# EAGLE schematic Schematic (EAGLE 7.3.0)
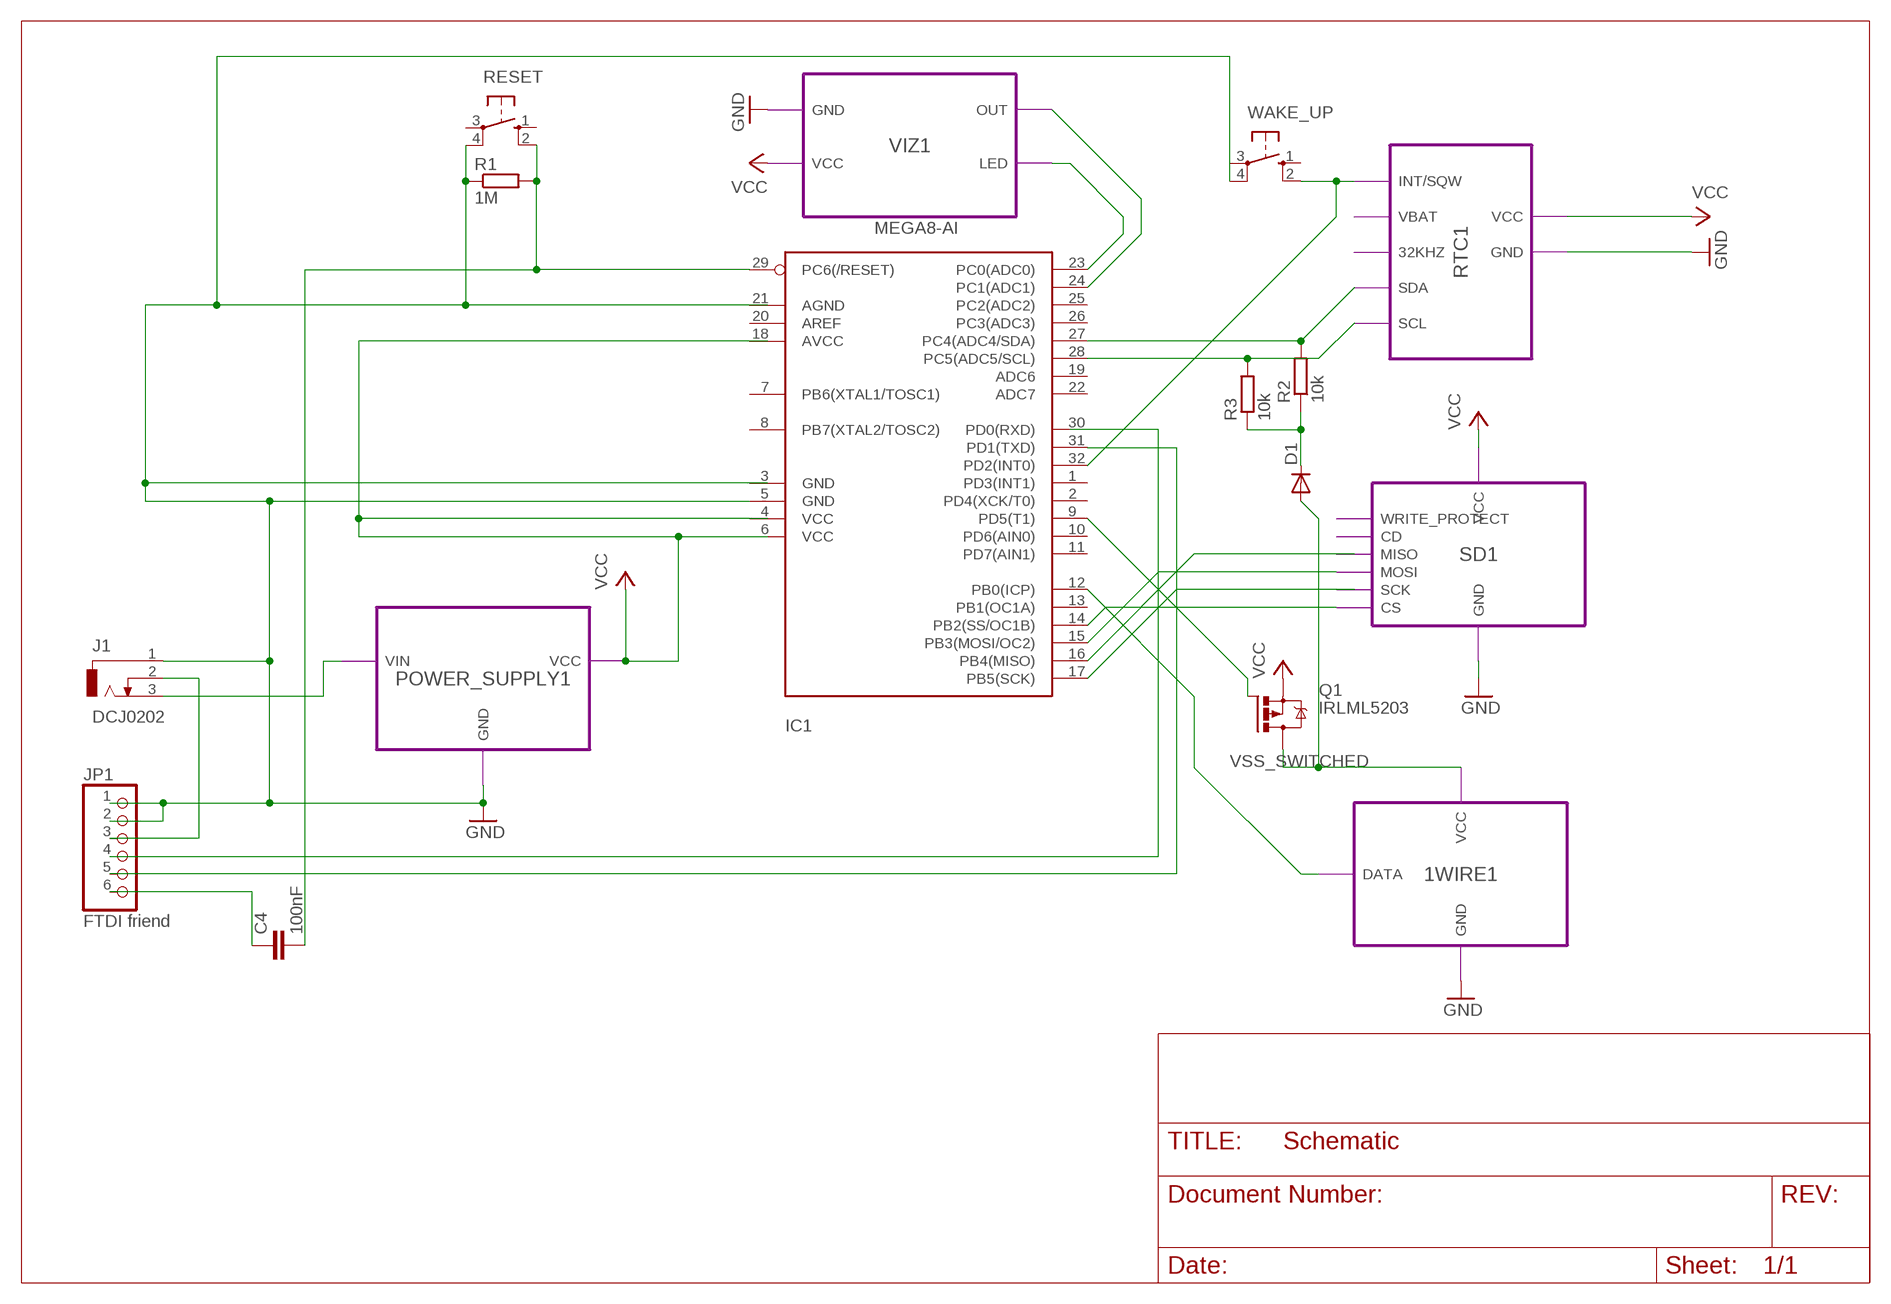
[diagram p0: schematic, sheet 1]

## Parts
C4  100nF  CC1608  [C1608]
D1  DIODE-DO214AA  [DO214AA]
IC1  MEGA8-AI  [TQFP32-08]
J1  DCJ0202  [DCJ0202]
JP1  FTDI friend  PINHD-1X6/90  [1X06/90]
Q1  IRLML5203  [MICRO3]
R1  1M  R-EU_R1206  [R1206]
R2  10k  R-EU_R1206  [R1206]
R3  10k  R-EU_R1206  [R1206]
RESET  10-XX  [B3F-10XX]
WAKE_UP  10-XX  [B3F-10XX]

## Module instances
POWER_SUPPLY1 = POWER_SUPPLY
RTC1 = RTC
SD1 = SDCARD
1WIRE1 = ONE_WIRE
VIZ1 = VISIBILITY_SENSOR

## Nets
DTR: C4.1 JP1.6
GND: IC1.5(GND) J1.1 JP1.1 JP1.2 R1.1 RESET.4(P1) WAKE_UP.4(P1) ; port RTC1.GND SD1.GND 1WIRE1.GND VIZ1.GND
N$1: IC1.9(PD5(T1)) Q1.1(G)
N$2: J1.3 ; port POWER_SUPPLY1.VIN
N$3: C4.2 IC1.29(PC6(/RESET)) R1.2 RESET.2(S1)
N$7: port POWER_SUPPLY1.GND
N$9: IC1.28(PC5(ADC5/SCL)) R3.2 ; port RTC1.SCL
N$10: IC1.27(PC4(ADC4/SDA)) R2.2 ; port RTC1.SDA
N$11: IC1.16(PB4(MISO))
N$12: IC1.15(PB3(MOSI/OC2)) ; port SD1.MOSI
N$13: IC1.17(PB5(SCK))
N$14: IC1.14(PB2(SS/OC1B)) ; port SD1.CS
N$15: IC1.32(PD2(INT0)) WAKE_UP.2(S1) ; port RTC1.INT/SQW
N$16: IC1.12(PB0(ICP)) ; port 1WIRE1.DATA
N$17: D1.C R2.1 R3.1
N$18: IC1.23(PC0(ADC0)) ; port VIZ1.LED
N$19: IC1.24(PC1(ADC1)) ; port VIZ1.OUT
RX: IC1.31(PD1(TXD)) JP1.5
TX: JP1.4
VCC: Q1.2(S) ; port POWER_SUPPLY1.VCC RTC1.VCC SD1.VCC VIZ1.VCC
VCC5V: J1.2 JP1.3
VSS_SWITCHED: D1.A Q1.3(D) ; port 1WIRE1.VCC
Unconnected: IC1.1(PD3(INT1)) IC1.2(PD4(XCK/T0)) IC1.3(GND) IC1.4(VCC) IC1.6(VCC) IC1.7(PB6(XTAL1/TOSC1)) IC1.8(PB7(XTAL2/TOSC2)) IC1.10(PD6(AIN0)) IC1.11(PD7(AIN1)) IC1.13(PB1(OC1A)) IC1.18(AVCC) IC1.19(ADC6) IC1.20(AREF) IC1.21(AGND) IC1.22(ADC7) IC1.25(PC2(ADC2)) IC1.26(PC3(ADC3)) IC1.30(PD0(RXD)) RESET.1(S) RESET.3(P) WAKE_UP.1(S) WAKE_UP.3(P)

## Library data of the parts
C4 = eagle-ltspice:C: CAPACITOR, European symbol; MF: AVX; MPN: 02016D104KAT2A; OC_FARNELL: 2280755; SPICEMODEL: NONE; SPICEPREFIX: C
D1 = diode:DIODE-: DIODE; OC_FARNELL: unknown
IC1 = avr-6:MEGA8: MICROCONTROLLER 8 Kbytes FLASH 1 kbytes SRAM 512 bytes EEPROM USART 6-channel 10 bit ADC 2-channel 8 bit ADC; OC_FARNELL: unknown
J1 = con-jack:DCJ0202: DC POWER JACK Source: DCJ0202.pdf; OC_FARNELL: unknown; OC_NEWARK: unknown
JP1 = pinhead:PINHD-1X6: PIN HEADER; OC_FARNELL: unknown; VV: v,,v
Q1 = transistor-power:IRLML5203: HEXFET P-Channel Power MOSFET; MF: FAIRCHILD SEMICONDUCTOR; MPN: FDN360P; OC_FARNELL: 9846336
R1 = resistor:R-EU_: RESISTOR, European symbol; OC_FARNELL: unknown
R2 R3 = rcl:R-EU_: RESISTOR, European symbol; OC_FARNELL: unknown
RESET WAKE_UP = switch-omron:10-XX: OMRON SWITCH; MF: OMRON ELECTRONIC COMPONENTS; MPN: B3F-1000; OC_FARNELL: 176432; OC_NEWARK: 36M3542

## Module POWER_SUPPLY
Ports: VCC(io) VIN(io) GND(io)
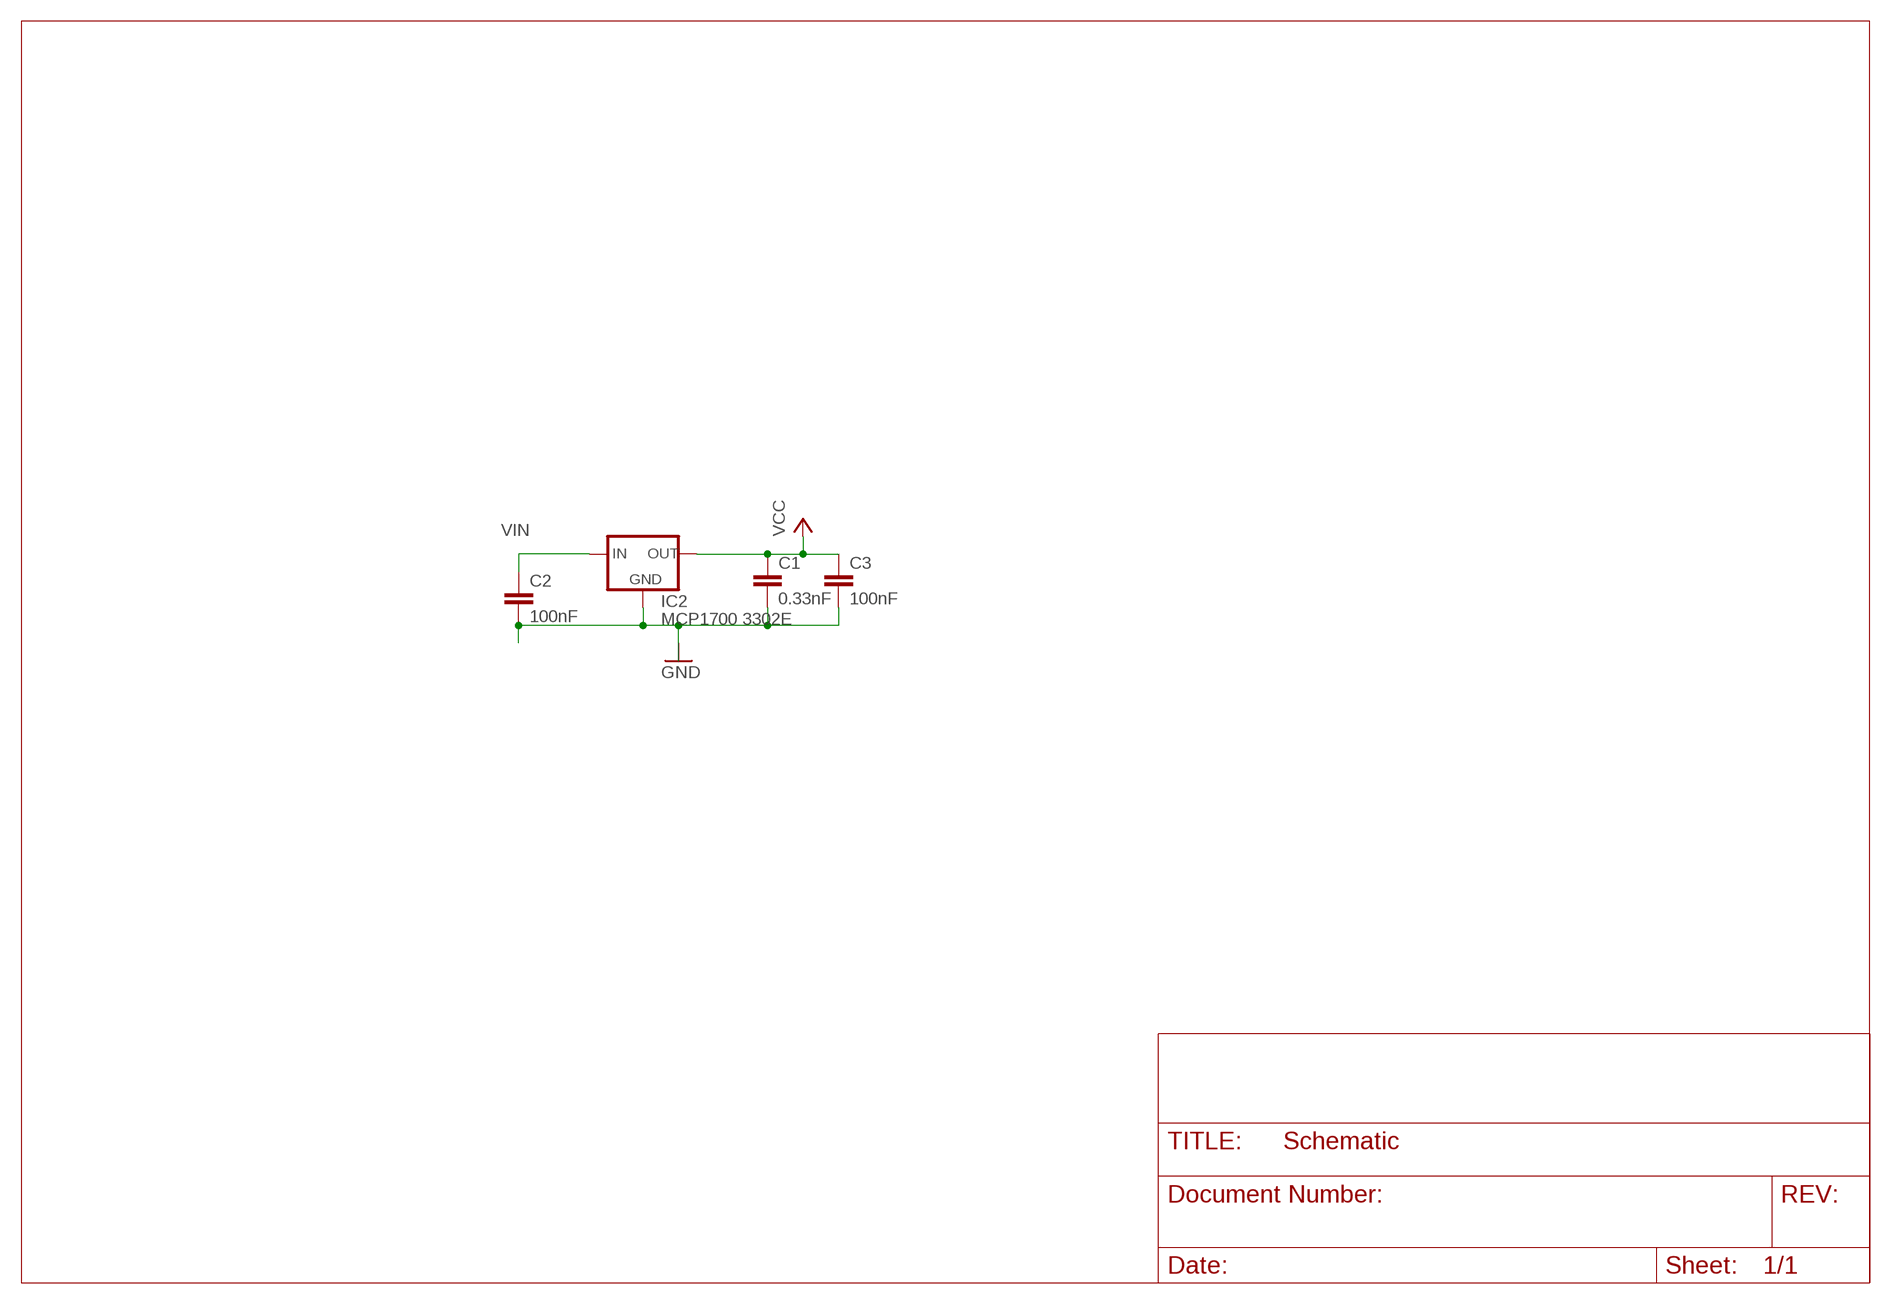
[diagram p1: schematic, module POWER_SUPPLY, sheet 1]

### Parts
C1  0.33nF  CC1608  [C1608]
C2  100nF  CC1608  [C1608]
C3  100nF  CC1608  [C1608]
IC2  MCP1700 3302E  MCP1700INLINE  [TO92-INLINE]

### Nets
GND: C1.2 C2.2 C3.2 IC2.1(GND)
VCC: C1.1 C3.1 IC2.3(OUT)
VIN: C2.1 IC2.2(IN)

### Library data of the parts
C1 = eagle-ltspice:C: CAPACITOR, European symbol; MF: AVX; MPN: 0201YC331KAT2A; OC_FARNELL: 1327618RL; SPICEMODEL: NONE; SPICEPREFIX: C
C2 C3 = eagle-ltspice:C: CAPACITOR, European symbol; MF: AVX; MPN: 02016D104KAT2A; OC_FARNELL: 2280755; SPICEMODEL: NONE; SPICEPREFIX: C
IC2 = adafruit:MCP1700: VOLTAGE REGULATOR; MF: MICROCHIP; MPN: MCP1700-3302E/TO; OC_FARNELL: 1296588

## Module RTC
Ports: GND(io) VCC(io) SCL(io) SDA(io) 32KHZ(io) INT/SQW(io) VBAT(io)
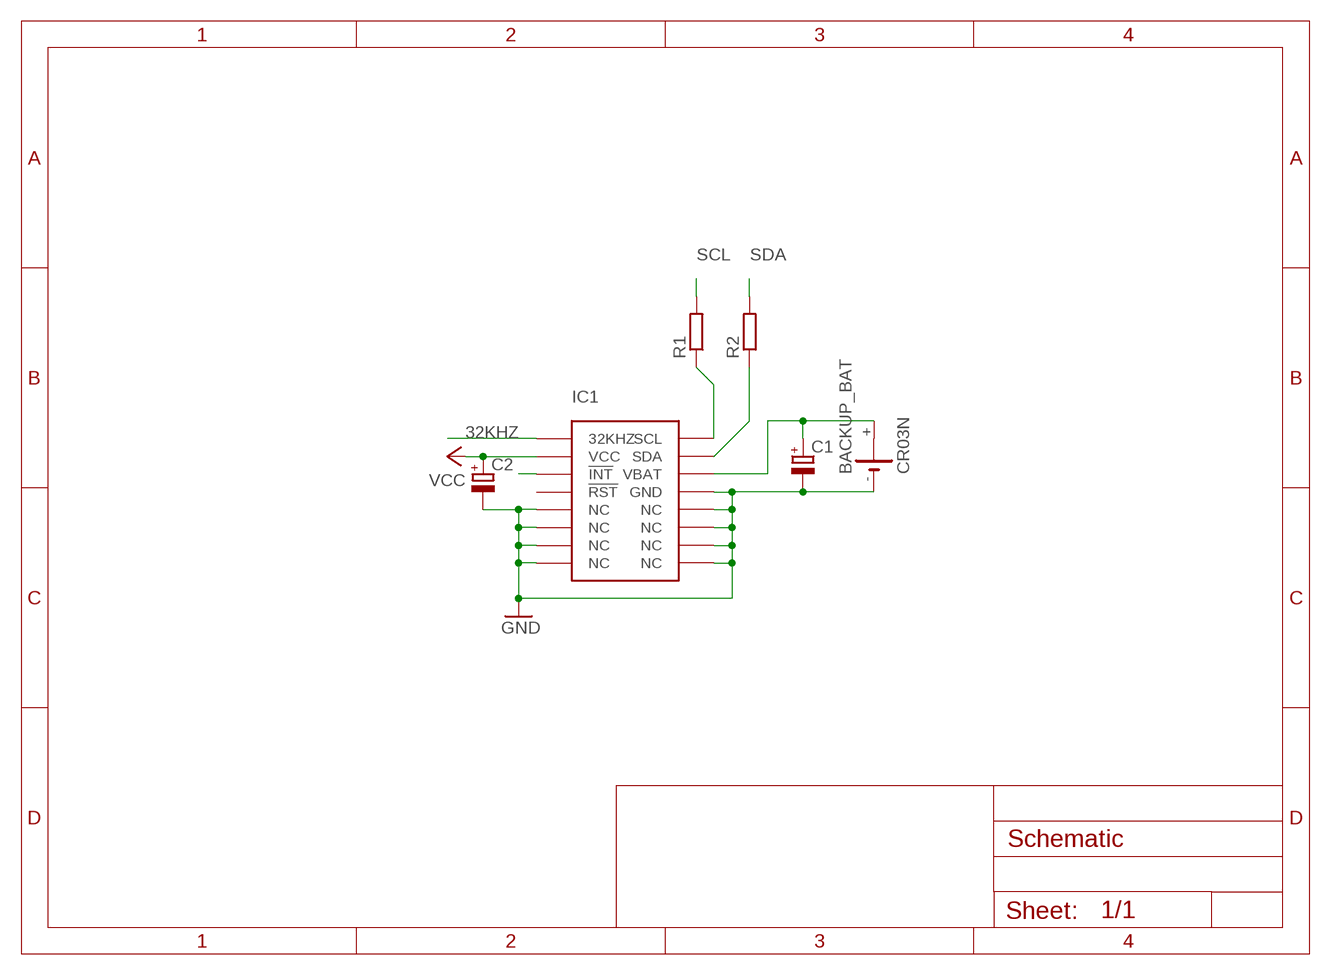
[diagram p2: schematic, module RTC, sheet 1]

### Parts
BACKUP_BAT  CR03N  [CR03N]
C1  CPOL-EUSMCC  [SMC_C]
C2  CPOL-EUSMCC  [SMC_C]
IC1  DS3231SOIC-16W  [SOIC-16W]
R1  R-EU_M1206  [M1206]
R2  R-EU_M1206  [M1206]

### Nets
32KHZ: IC1.1(32KHZ)
GND: BACKUP_BAT.- C1.- C2.- IC1.5(NC) IC1.6(NC) IC1.7(NC) IC1.8(NC) IC1.9(NC) IC1.10(NC) IC1.11(NC) IC1.12(NC) IC1.13(GND)
INT/SQW: IC1.3(!INT)
N$1: IC1.15(SDA) R2.1
N$2: IC1.16(SCL) R1.1
SCL: R1.2
SDA: R2.2
VBAT: BACKUP_BAT.+ C1.+ IC1.14(VBAT)
VCC: C2.+ IC1.2(VCC)
Unconnected: BACKUP_BAT.+@1(+) IC1.4(!RST)

### Library data of the parts
BACKUP_BAT = battery:CR03N: LI BATTERY Sonnenschein; OC_FARNELL: unknown
C1 C2 = rcl:CPOL-EU: POLARIZED CAPACITOR, European symbol; OC_FARNELL: unknown
IC1 = DS3231_industrialberry:DS3231; OC_FARNELL: unknown
R1 R2 = resistor:R-EU_: RESISTOR, European symbol; MF: BOURNS; MPN: CRM1206-FX-10R0ELF; OC_FARNELL: 1865248RL

## Module SDCARD
Ports: VCC(io) GND(io) WRITE_PROTECT(io) CD(io) MISO(io) MOSI(io) SCK(io) CS(io)
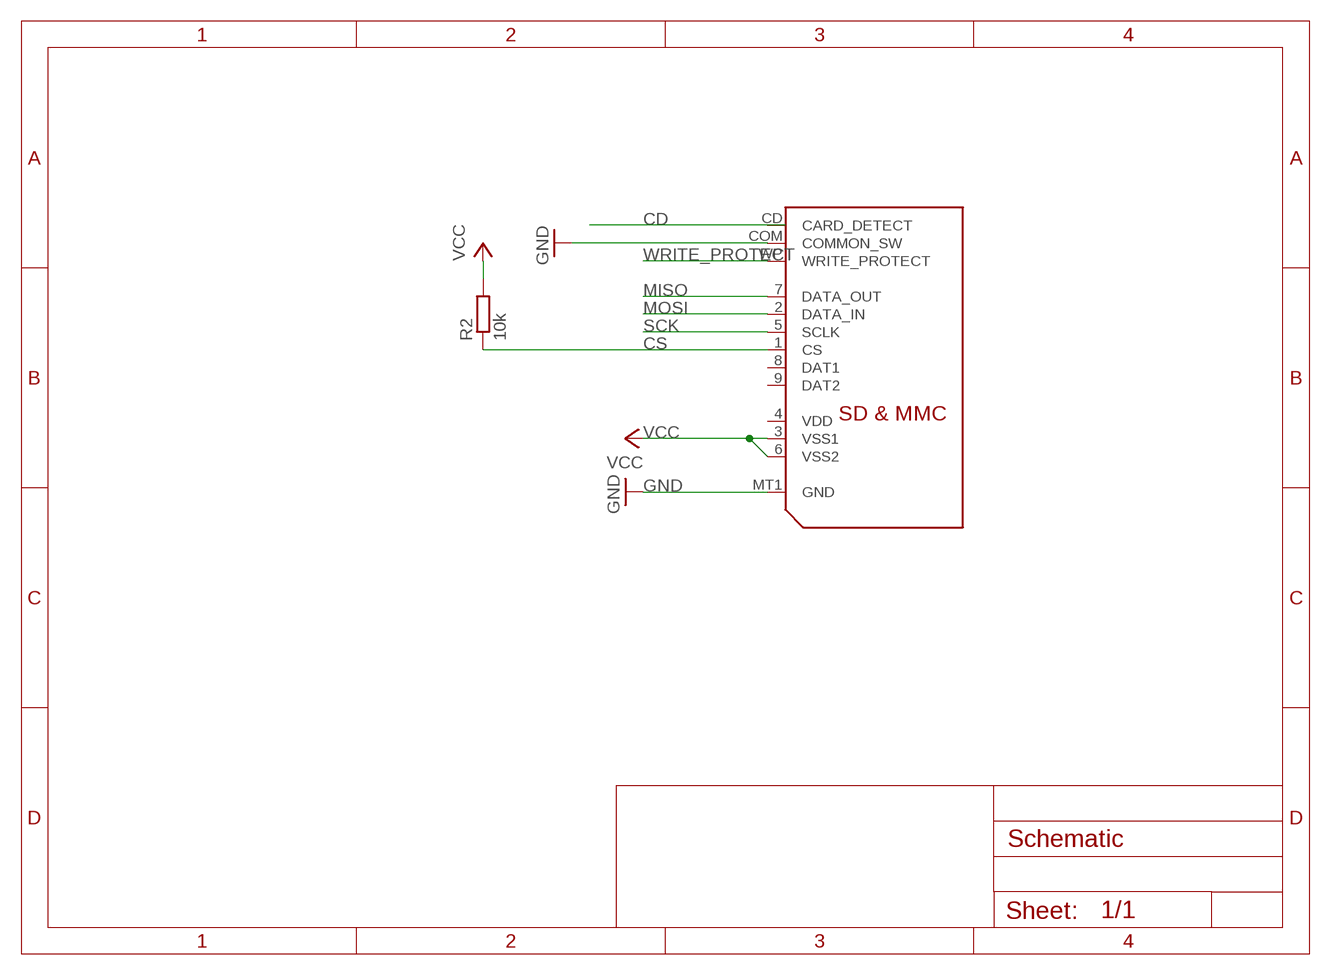
[diagram p3: schematic, module SDCARD, sheet 1]

### Parts
R2  10k  R-EU_M1206  [M1206]
U$1  SDMMC18650  [SDCARD]

### Nets
CS: R2.1 U$1.1(CS)
GND: U$1.COM(COMMON_SW) U$1.MT1(GND)
MISO: U$1.7(DATA_OUT)
MOSI: U$1.2(DATA_IN)
SCK: U$1.5(SCLK)
VCC: R2.2 U$1.3(VSS1) U$1.6(VSS2)
WRITE_PROTECT: U$1.WP(WRITE_PROTECT)
Unconnected: U$1.4(VDD) U$1.8(DAT1) U$1.9(DAT2) U$1.CD(CARD_DETECT)

### Library data of the parts
R2 = rcl:R-EU_: RESISTOR, European symbol; OC_FARNELL: unknown
U$1 = adafruit:SDMMC: SD MMC Card holder 4UCON part #06132 - easy to solder; OC_FARNELL: unknown

## Module ONE_WIRE
Ports: VCC(io) DATA(io) GND(io)
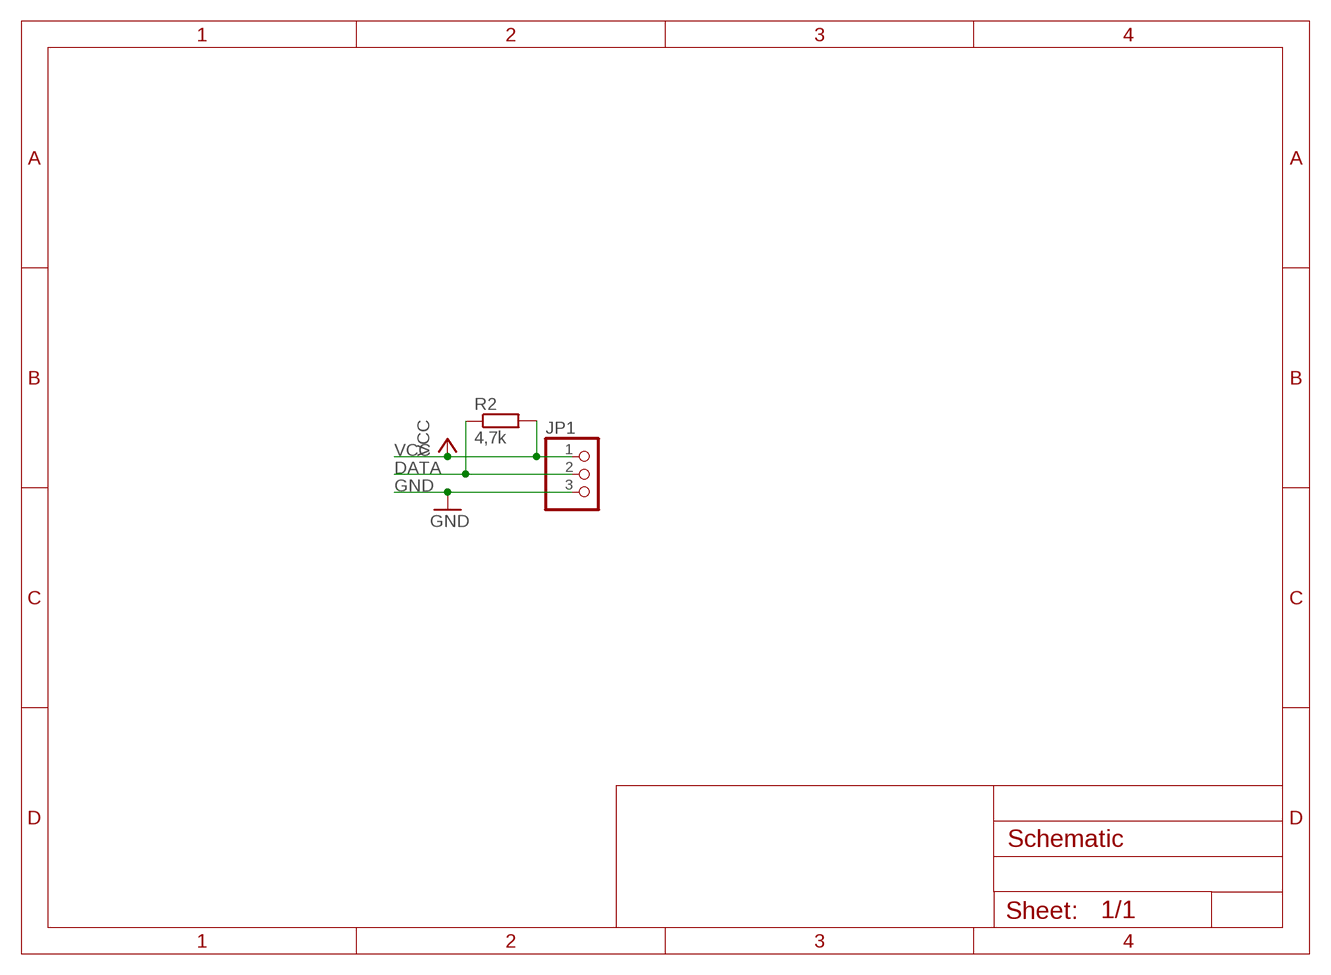
[diagram p4: schematic, module ONE_WIRE, sheet 1]

### Parts
JP1  PINHD-1X3/90  [1X03/90]
R2  4,7k  R-EU_R1206  [R1206]

### Nets
DATA: JP1.2 R2.1
GND: JP1.3
VCC: JP1.1 R2.2

### Library data of the parts
JP1 = pinhead:PINHD-1X3: PIN HEADER; OC_FARNELL: unknown
R2 = resistor:R-EU_: RESISTOR, European symbol; MF: PANASONIC ELECTRONIC COMPONENTS; MPN: ERJB1AF472U; OC_FARNELL: 2293982RL

## Module VISIBILITY_SENSOR
Ports: GND(io) VCC(io) OUT(io) LED(io)
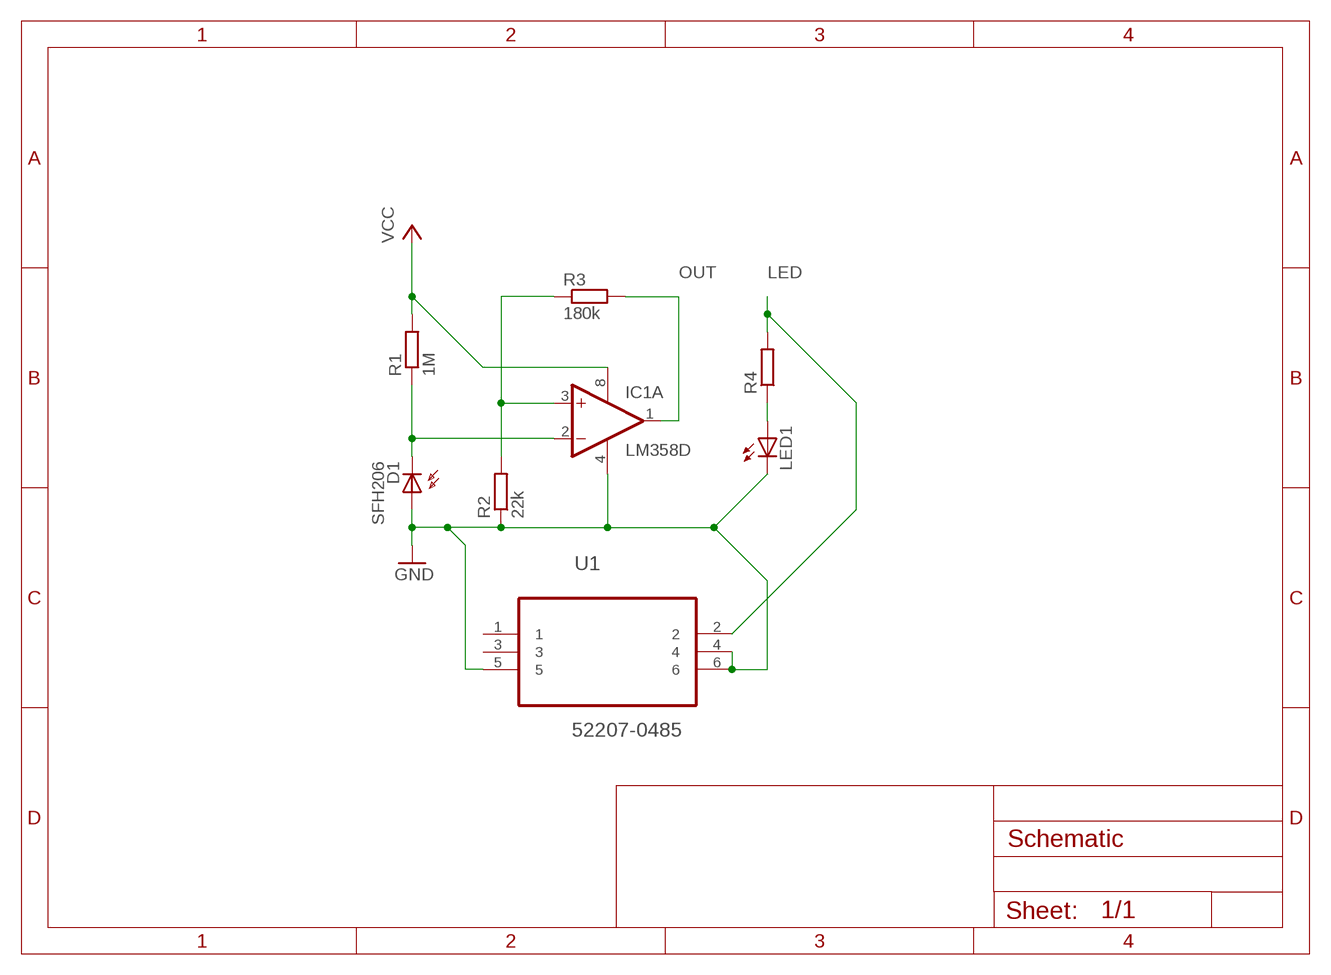
[diagram p5: schematic, module VISIBILITY_SENSOR, sheet 1]

### Parts
D1  SFH206  [SFH206]
IC1  LM358D  [SO08]
LED1  LED5MM  [LED5MM]
R1  1M  R-EU_R1206  [R1206]
R2  22k  R-EU_R1206  [R1206]
R3  180k  R-EU_R1206  [R1206]
R4  R-EU_R1206  [R1206]
U1  52207-0485  [MOLEX_52207-0485]

### Nets
GND: D1.A IC1.4(P:V-) LED1.K(C) R2.1 U1.4 U1.5 U1.6
LED: R4.2 U1.2
N$1: D1.K(C) IC1.2(A:-IN) R1.1
N$2: LED1.A R4.1
N$3: IC1.3(A:+IN) R2.2 R3.1
OUT: IC1.1(A:OUT) R3.2
VCC: IC1.8(P:V+) R1.2
Unconnected: IC1.5(B:+IN) IC1.6(B:-IN) IC1.7(B:OUT) U1.1 U1.3

### Library data of the parts
D1 = opto-trans-siemens:SFH206: PHOTO DIODE; MF: OSRAM; MPN: SFH206K; OC_FARNELL: 1212741; OC_NEWARK: 01M8807
IC1 = linear:LM358: OP AMP also LM158; LM258; LM2904 Source: http://cache.national.com/ds/LM/LM158.pdf; MF: TEXAS INSTRUMENTS; MPN: LM358DR; OC_FARNELL: 1648685
LED1 = adafruit:LED: LED OSRAM: - CHIPLED LG R971, LG N971, LY N971, LG Q971, LY Q971, LO R971, LY R971 LH N974, LH R974 LS Q976, LO Q976, LY Q976 LO Q996 - Hyper CHIPLED LW Q18S LB Q993, LB Q99A, LB R99A - SideLED LS A670, LO A670, LY A670, LG A670, LP A670 LB A673, LV A673, LT A673, LW A673 LH A674 LY A675 LS A676, LA A676, LO A676, LY A676, LW A676 LS A679, LY A679, LG A679 - Hyper Micro SIDELED® LS Y876, LA Y876, LO Y876, LY Y876 LT Y87S - SmartLED LW L88C, LW L88S LB L89C, LB L89S, LG L890 LS L89K, LO L89K, LY L89K LS L896, LA L896, LO L896, LY L896 - TOPLED LS T670, LO T670, LY T670, LG T670, LP T670 LSG T670, LSP T670, LSY T670, LOP T670, LYG T670 LG T671, LOG T671, LSG T671 LB T673, LV T673, LT T673, LW T673 LH T674 LS T676, LA T676, LO T676, LY T676, LB T676, LH T676, LSB T676, LW T676 LB T67C, LV T67C, LT T67C, LS T67K, LO T67K, LY T67K, LW E67C LS E67B, LA E67B, LO E67B, LY E67B, LB E67C, LV E67C, LT E67C LW T67C LS T679, LY T679, LG T679 LS T770, LO T770, LY T770, LG T770, LP T770 LB T773, LV T773, LT T773, LW T773 LH T774 LS E675, LA E675, LY E675, LS T675 LS T776, LA T776, LO T776, LY T776, LB T776 LHGB T686 LT T68C, LB T68C - Hyper Mini TOPLED® LB M676 - Mini TOPLED Santana® LG M470 LS M47K, LO M47K, LY M47K Source: http://www.osram.convergy.de/; MF: WURTH ELEKTRONIK; MPN: 151053GS03000; OC_FARNELL: 2322123
R1 R2 = rcl:R-EU_: RESISTOR, European symbol; OC_FARNELL: unknown
R3 = rcl:R-EU_: RESISTOR, European symbol; MF: TE CONNECTIVITY; MPN: CRGH1206F180K; OC_FARNELL: 2332170
R4 = rcl:R-EU_: RESISTOR, European symbol
U1 = Molex_By_element14_Batch_1:52207-0485: SOCKET FPC, SMT, 1MM, 4 WAY; MPN: 52207-0485; OC_FARNELL: 1463013; OC_NEWARK: 58J9499; PACKAGE: SOCKET FPC, SMT, 1MM, 4 WAY; SUPPLIER: Molex